# EasyEDA Pro project ProPrj_Piano_scan_for_conserts3_2026-02-26.epro, schematic reuse_connectors-4
Board Name: reuse_connectors-4; Create Date: 2025-11-23; Page Name: rc-4; Project Name: Piano_scan_for_conserts; Schematic Name: reuse_connectors-4; Update Date: 2025-11-23; Company: EasyEDA.com; Page Size: A4; Version: V1.0
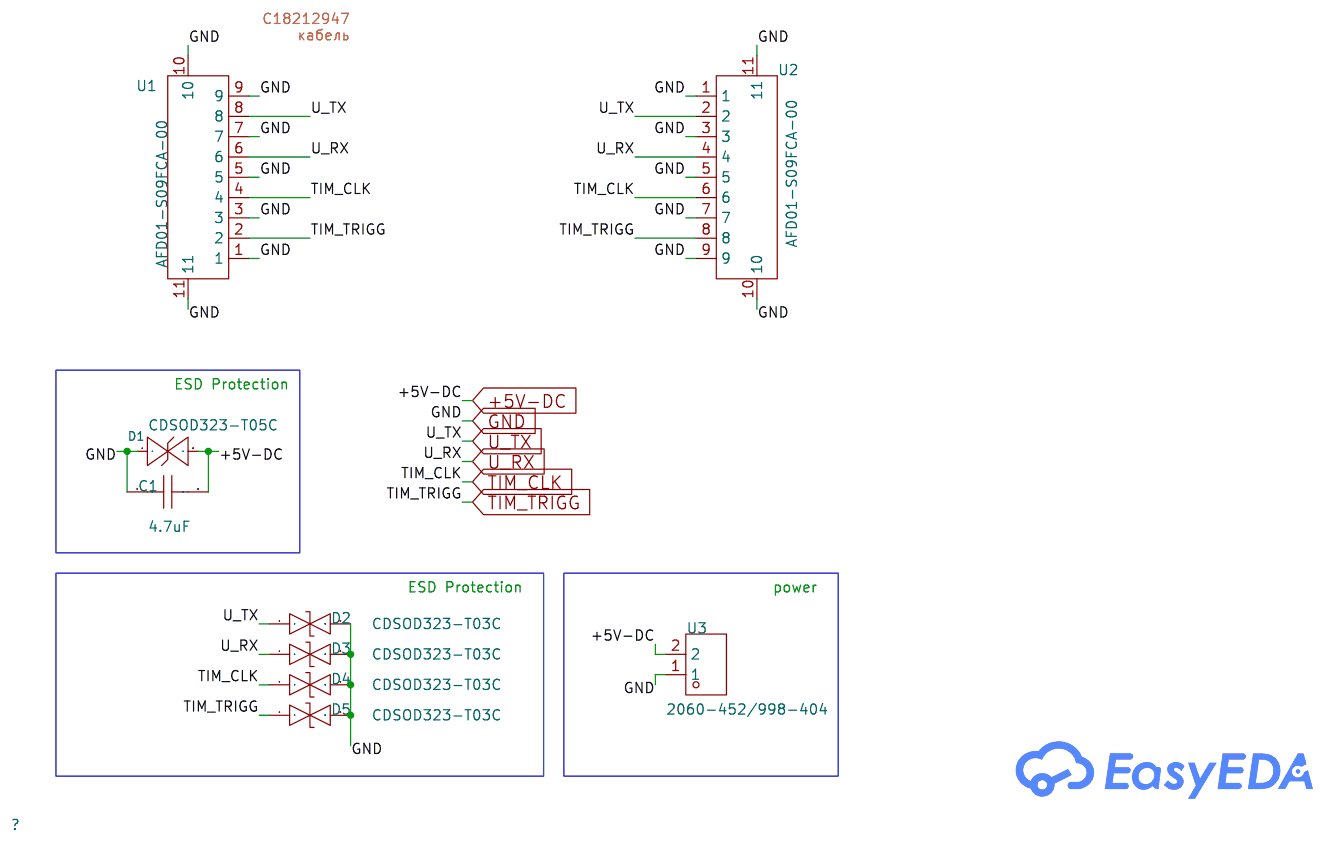
[diagram p2: schematic sheet]

## Parts
C1  4.7uF  [C0402]
D1  CDSOD323-T05C  [SOD-323_L1.8-W1.3-LS2.5-BI]
D2  CDSOD323-T03C  [SOD-323_L1.8-W1.3-LS2.5-BI]
D3  CDSOD323-T03C  [SOD-323_L1.8-W1.3-LS2.5-BI]
D4  CDSOD323-T03C  [SOD-323_L1.8-W1.3-LS2.5-BI]
D5  CDSOD323-T03C  [SOD-323_L1.8-W1.3-LS2.5-BI]
U1  AFD01-S09FCA-00  [FPC-SMD_9P-P0.50_JS_AFD01-S09FCA-00]
U2  AFD01-S09FCA-00  [FPC-SMD_9P-P0.50_JS_AFD01-S09FCA-00]
U3  2060-452/998-404  [CONN-SMD_2060-452]

## Library data of the parts
C1 = CL05A475MO5NUNC: Capacitance: Tolerance:±20% Tolerance:±20% Voltage Rated: Temperature Coefficient:; LCSC Part Name: 4.7uF ±20% 16V; Supplier Part: C318563; Manufacturer: SAMSUNG(三星); Supplier Footprint: 0402; JLCPCB Part Class: Extended Part; Datasheet: https://atta.szlcsc.com/upload/public/pdf/source/20220707/F14E03FDB4B4C1D977DC3E44ED5514DB.pdf; Supplier: LCSC; Tolerance: ±20%
D1 = CDSOD323-T05C: Maximum Clamping Voltage:18.3V Breakdown Voltage:6V Number of Lines:单路 Type:ESD; Supplier Part: C711706; Manufacturer: BOURNS; Supplier Footprint: SOD-323; JLCPCB Part Class: Extended Part; Datasheet: https://atta.szlcsc.com/upload/public/pdf/source/20200729/C711705_B092C80AA6073E77CC27CA73EB4B9B57.pdf; Supplier: LCSC; Maximum Clamping Voltage: 18.3V; Breakdown Voltage: 6V; Number of Lines: 单路; Type: ESD
D2-D5 = CDSOD323-T03C: Reverse Stand-Off Voltage (Vrwm):3.3V Maximum Clamping Voltage:19V Peak Pulse Power Dissipation (Ppp)@10/1000us:350W Breakdown Voltage:4V Number of Lines:单路 Operating Temperature:-55℃~+150℃@(Tj) Operating Temperature:-55℃~+150℃@(Tj) Type:ESD; Supplier Part: C711705; Manufacturer: BOURNS; Supplier Footprint: SOD-323; JLCPCB Part Class: Extended Part; Datasheet: https://atta.szlcsc.com/upload/public/pdf/source/20200729/C711705_B092C80AA6073E77CC27CA73EB4B9B57.pdf; Supplier: LCSC; Reverse Stand-Off Voltage (Vrwm): 3.3V; Maximum Clamping Voltage: 19V; Peak Pulse Power Dissipation (Ppp)@10/1000us: 350W; Breakdown Voltage: 4V; Number of Lines: 单路; Operating Temperature: -55℃~+150℃@(Tj); Type: ESD
U1 U2 = AFD01-S09FCA-00: Locking Feature:Flip type Contact Type:Bottom Contact Number of Contacts:9P Pitch:0.5mm Mounting Type:Surface Mount Height Above Board:2mm; LCSC Part Name: 间距:0.5mm P数:9P 翻盖式 下接; Supplier Part: C18198577; Manufacturer: JS(钜硕电子); Supplier Footprint: SMD,P=0.5mm,卧贴; JLCPCB Part Class: Extended Part; Datasheet: https://atta.szlcsc.com/upload/public/pdf/source/20230921/C984413AEFF3A883511B509B58F9A1F7.pdf; Supplier: LCSC; Locking Feature: Flip type; Contact Type: Bottom Contact; Number of Contacts: 9P; Pitch: 0.5mm; Mounting Type: Surface Mount; Height Above Board: 2mm
U3 = 2060-452/998-404: Structure:1x2P Pitch:4mm Color:White Mounting Style:- Number of Pins:2P Number of PINs Per Row:2 Number of Rows:1 Current Rating (Max):9A Voltage Rating (Max):320V Wire Gauge - AWG:18~24 Wire Gauge - mm2:- Operating Temperature Range:-60℃~+105℃ Operating; LCSC Part Name: 1x2P 4mm 每排P数:2 排数:1; Supplier Part: C2765055; Manufacturer: WAGO(万可); Supplier Footprint: SMD,P=4mm; JLCPCB Part Class: Extended Part; Datasheet: https://atta.szlcsc.com/upload/public/pdf/source/20210406/C2765055_56EE5E040DB4B2E747AE8E3BFC9B5745.pdf; Supplier: LCSC; Structure: 1x2P; Pitch: 4mm; Color: White; Number of Pins: 2P; Number of PINs Per Row: 2; Number of Rows: 1; Current Rating (Max): 9A; Voltage Rating (Max): 320V; Wire Gauge - AWG: 18~24; Operating Temperature Range: -60℃~+105℃

## Nets
+5V-DC: C1.2 D1.2(A) U3.2
GND: C1.1 D1.1(K) D2.2 D3.2 D4.2 D5.2 U1.1 U1.3 U1.5 U1.7 U1.9 U1.10 U1.11 U2.1 U2.3 U2.5 U2.7 U2.9 U2.10 U2.11 U3.1
TIM_CLK: D4.1 U1.4 U2.6
TIM_TRIGG: D5.1 U1.2 U2.8
U_RX: D3.1 U1.6 U2.4
U_TX: D2.1 U1.8 U2.2

## Notes on the sheet
- C18212947
  кабель
- ESD Protection
- ESD Protection
- power
